# Altium schematic sheet power.SchDoc
size A4; SheetNumber: 4; SheetTotal: 6; SPICEModelCacheBNSZVLDZ: <root> / <DocumentId>BNSZVLDZ</DocumentId> / <CacheFrame Number="0"> / <Model Name="spstrelay" Kind="CKT"> / <Text>*SPST Relay Subcircuit Parameters / *PULLIN     = Pull in voltage / *DROPOFF    = Drop off voltage / *CONTACT    = Contact resistance / *RESISTANCE = Coil resistance / *INDUCTANCE = Coil Inductance / * jjt 15/6/2002: changed DPST model to SPST. / * / *Generic DPST Relay / *Connections:     NO_A1 / *                 | NO_A2 / *                 | | T1 / *                 | | | T2 / *                 | | | | / *                 | | | | / *                 | | | | / *                 | | | | / .SUBCKT SPSTRELAY 1 2 4 5 / + PARAMS: PULLIN=4 DROPOFF=0.1 CONTACT=1m RESISTANCE=500 INDUCTANCE=10m / L1 4 6 {(INDUCTANCE/2)} / L2 5 7 {(INDUCTANCE/2)} / R1 6 7 {RESISTANCE} / * / BNO1 8 0 V={PULLIN}-abs(v(6,7)) / SW1 1 2 8 0 SWNO OFF / * / .MODEL SWNO SW(VT={(PULLIN*0.98)} RON={CONTACT} ) / .ENDS SPSTRELAY</Text> / </Model> / </CacheFrame> / </root>
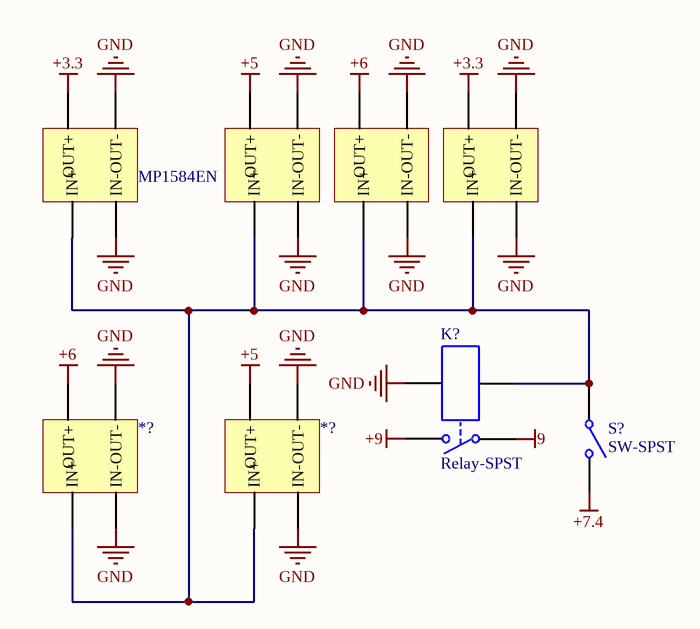
[diagram p0: power.SchDoc]

## Parts
(Parts that share a designator on the sheet are numbered #1, #2 ... from top to bottom, then left to right.)
*?#1  MP1584EN
*?#2  MP1584EN  (value not drawn)
*?#3  MP1584EN  (value not drawn)
*?#4  MP1584EN  (value not drawn)
*?#5  MP1584EN  (value not drawn)
*?#6  MP1584EN  (value not drawn)
K?  Relay-SPST  [MODULE4]
S?  SW-SPST  [SPST-2]

## Nets
9: K?.1
+3.3: *?#1.2(OUT+) *?#4.2(OUT+)
+5: *?#2.2(OUT+) *?#6.2(OUT+)
+6: *?#3.2(OUT+) *?#5.2(OUT+)
+9: K?.2
GND: *?#1.1(IN-) *?#1.3(OUT-) *?#2.1(IN-) *?#2.3(OUT-) *?#3.1(IN-) *?#3.3(OUT-) *?#4.1(IN-) *?#4.3(OUT-) *?#5.1(IN-) *?#5.3(OUT-) *?#6.1(IN-) *?#6.3(OUT-) K?.4
Net*?#1_0: *?#1.0(IN+) *?#2.0(IN+) *?#3.0(IN+) *?#4.0(IN+) *?#5.0(IN+) *?#6.0(IN+) K?.3 S?.1(COMMON)

Not connected (* = marked no-connect by the designer): S? 2(NO)

## Notes on the sheet
- Labels drawn without touching a wire or pin: +7.4

## Library data of the parts
K? = Relay-SPST: Single-Pole Single-Throw Relay; Published: 24-Mar-1999; LatestRevisionDate: 17-Jul-2002; LatestRevisionNote: Re-released for DXP Platform.; PackageReference: MODULE4; Publisher: Altium Limited
S? = SW-SPST: Single-Pole, Single-Throw Switch; Published: 24-Mar-1999; LatestRevisionDate: 17-Jul-2002; LatestRevisionNote: Re-released for DXP Platform.; PackageReference: SPST-2; Publisher: Altium Limited; PackageDescription: Switch; 2 Leads